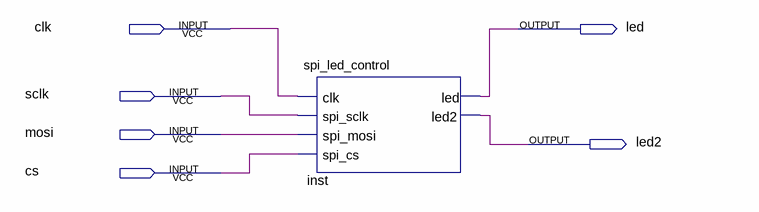
[diagram p0: schematic sheet]
// Quartus schematic ledblibk.bdf as structural Verilog: 1 symbols, 6 pins
module ledblibk (
  input  clk,
  input  sclk,
  input  mosi,
  input  cs,
  output led,
  output led2
);

  spi_led_control inst (.clk(clk), .spi_sclk(sclk), .spi_mosi(mosi), .spi_cs(cs), .led(led), .led2(led2));
endmodule
